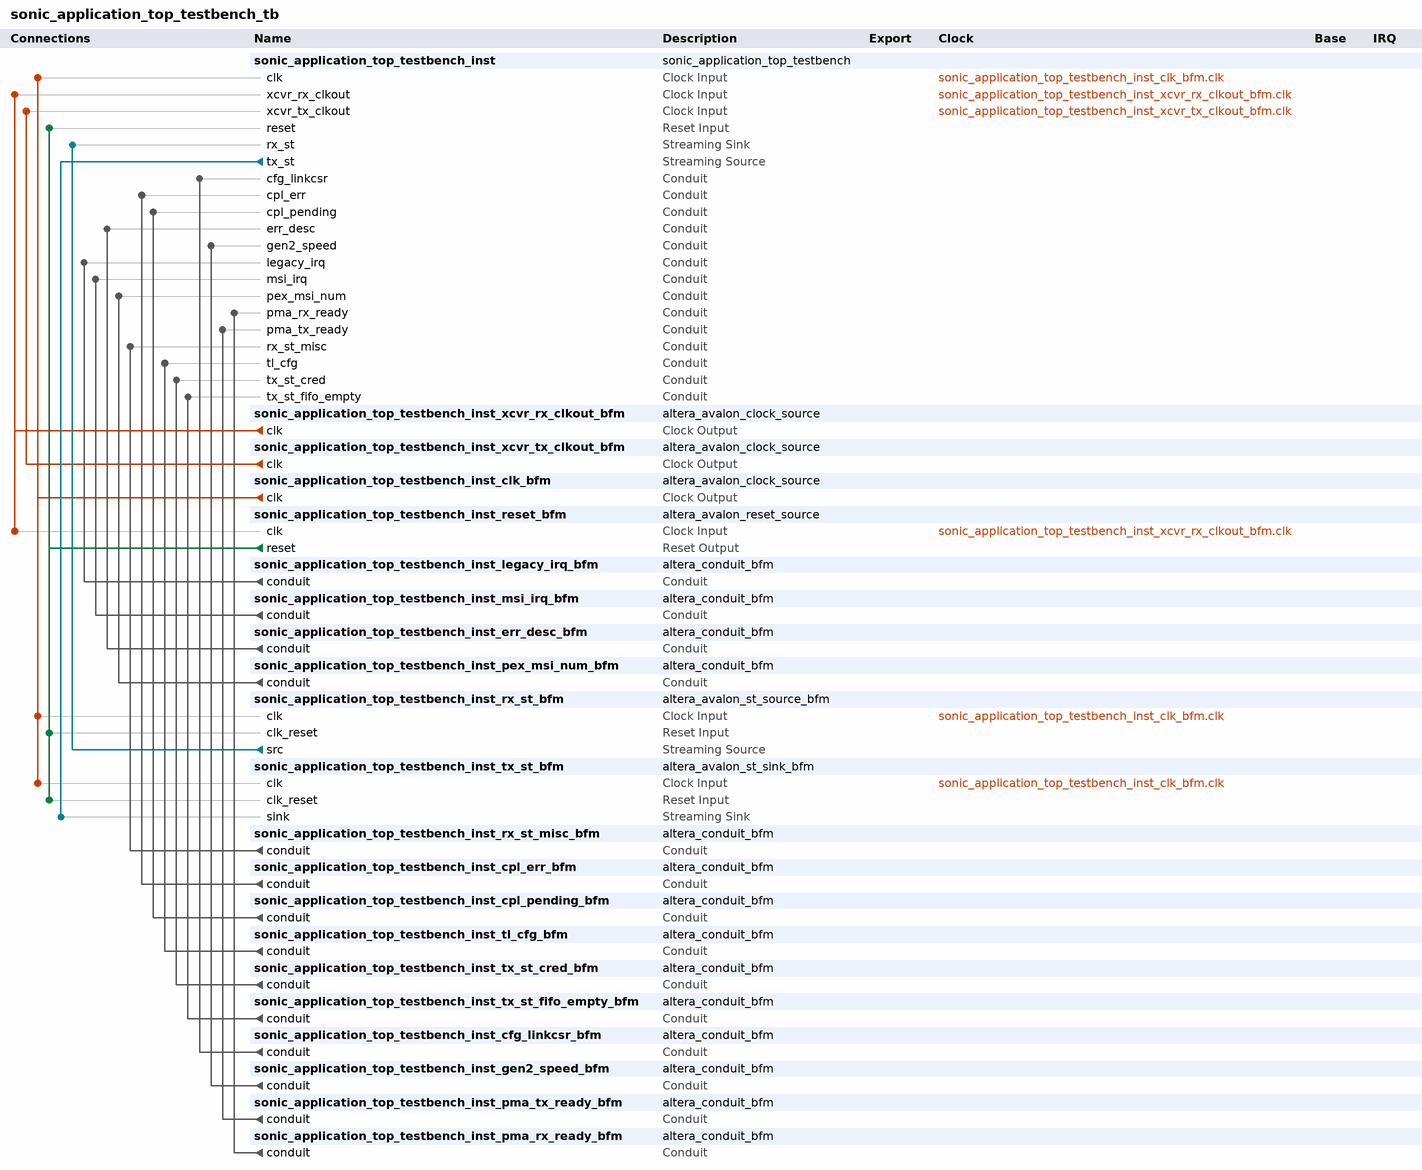
[diagram p0: system contents]
# Platform Designer (Qsys) system sonic_application_top_testbench_tb
# Parameters at their usual value, and those the tool derives, are not listed.
package require -exact qsys 11.0
create_system sonic_application_top_testbench_tb
set_project_property DEVICE_FAMILY STRATIXIV

add_instance sonic_application_top_testbench_inst sonic_application_top_testbench 1.0

add_instance sonic_application_top_testbench_inst_xcvr_rx_clkout_bfm altera_avalon_clock_source 11.0
set_instance_parameter_value sonic_application_top_testbench_inst_xcvr_rx_clkout_bfm CLOCK_RATE 257

add_instance sonic_application_top_testbench_inst_xcvr_tx_clkout_bfm altera_avalon_clock_source 11.0
set_instance_parameter_value sonic_application_top_testbench_inst_xcvr_tx_clkout_bfm CLOCK_RATE 257

add_instance sonic_application_top_testbench_inst_clk_bfm altera_avalon_clock_source 11.0
set_instance_parameter_value sonic_application_top_testbench_inst_clk_bfm CLOCK_RATE 250

add_instance sonic_application_top_testbench_inst_reset_bfm altera_avalon_reset_source 11.0
set_instance_parameter_value sonic_application_top_testbench_inst_reset_bfm ASSERT_HIGH_RESET 0
set_instance_parameter_value sonic_application_top_testbench_inst_reset_bfm INITIAL_RESET_CYCLES 50

add_instance sonic_application_top_testbench_inst_legacy_irq_bfm altera_conduit_bfm 11.0
set_instance_parameter_value sonic_application_top_testbench_inst_legacy_irq_bfm SIGNAL_ROLES sts,ack
set_instance_parameter_value sonic_application_top_testbench_inst_legacy_irq_bfm SIGNAL_WIDTHS 1,1
set_instance_parameter_value sonic_application_top_testbench_inst_legacy_irq_bfm SIGNAL_DIRECTIONS input,output

add_instance sonic_application_top_testbench_inst_msi_irq_bfm altera_conduit_bfm 11.0
set_instance_parameter_value sonic_application_top_testbench_inst_msi_irq_bfm SIGNAL_ROLES num,ack,req,tc
set_instance_parameter_value sonic_application_top_testbench_inst_msi_irq_bfm SIGNAL_WIDTHS 5,1,1,3
set_instance_parameter_value sonic_application_top_testbench_inst_msi_irq_bfm SIGNAL_DIRECTIONS input,output,input,input

add_instance sonic_application_top_testbench_inst_err_desc_bfm altera_conduit_bfm 11.0
set_instance_parameter_value sonic_application_top_testbench_inst_err_desc_bfm SIGNAL_WIDTHS 128
set_instance_parameter_value sonic_application_top_testbench_inst_err_desc_bfm SIGNAL_DIRECTIONS input

add_instance sonic_application_top_testbench_inst_pex_msi_num_bfm altera_conduit_bfm 11.0
set_instance_parameter_value sonic_application_top_testbench_inst_pex_msi_num_bfm SIGNAL_WIDTHS 5
set_instance_parameter_value sonic_application_top_testbench_inst_pex_msi_num_bfm SIGNAL_DIRECTIONS input

add_instance sonic_application_top_testbench_inst_rx_st_bfm altera_avalon_st_source_bfm 11.0
set_instance_parameter_value sonic_application_top_testbench_inst_rx_st_bfm USE_PACKET 1
set_instance_parameter_value sonic_application_top_testbench_inst_rx_st_bfm USE_CHANNEL 0
set_instance_parameter_value sonic_application_top_testbench_inst_rx_st_bfm USE_ERROR 1
set_instance_parameter_value sonic_application_top_testbench_inst_rx_st_bfm USE_READY 1
set_instance_parameter_value sonic_application_top_testbench_inst_rx_st_bfm USE_VALID 1
set_instance_parameter_value sonic_application_top_testbench_inst_rx_st_bfm USE_EMPTY 1
set_instance_parameter_value sonic_application_top_testbench_inst_rx_st_bfm ST_SYMBOL_W 128
set_instance_parameter_value sonic_application_top_testbench_inst_rx_st_bfm ST_NUMSYMBOLS 1
set_instance_parameter_value sonic_application_top_testbench_inst_rx_st_bfm ST_CHANNEL_W 1
set_instance_parameter_value sonic_application_top_testbench_inst_rx_st_bfm ST_ERROR_W 1
set_instance_parameter_value sonic_application_top_testbench_inst_rx_st_bfm ST_MAX_CHANNELS 0

add_instance sonic_application_top_testbench_inst_tx_st_bfm altera_avalon_st_sink_bfm 11.0
set_instance_parameter_value sonic_application_top_testbench_inst_tx_st_bfm USE_PACKET 1
set_instance_parameter_value sonic_application_top_testbench_inst_tx_st_bfm USE_CHANNEL 0
set_instance_parameter_value sonic_application_top_testbench_inst_tx_st_bfm USE_ERROR 1
set_instance_parameter_value sonic_application_top_testbench_inst_tx_st_bfm USE_READY 1
set_instance_parameter_value sonic_application_top_testbench_inst_tx_st_bfm USE_VALID 1
set_instance_parameter_value sonic_application_top_testbench_inst_tx_st_bfm USE_EMPTY 1
set_instance_parameter_value sonic_application_top_testbench_inst_tx_st_bfm ST_SYMBOL_W 128
set_instance_parameter_value sonic_application_top_testbench_inst_tx_st_bfm ST_NUMSYMBOLS 1
set_instance_parameter_value sonic_application_top_testbench_inst_tx_st_bfm ST_CHANNEL_W 1
set_instance_parameter_value sonic_application_top_testbench_inst_tx_st_bfm ST_ERROR_W 1
set_instance_parameter_value sonic_application_top_testbench_inst_tx_st_bfm ST_READY_LATENCY 0
set_instance_parameter_value sonic_application_top_testbench_inst_tx_st_bfm ST_MAX_CHANNELS 0

add_instance sonic_application_top_testbench_inst_rx_st_misc_bfm altera_conduit_bfm 11.0
set_instance_parameter_value sonic_application_top_testbench_inst_rx_st_misc_bfm SIGNAL_ROLES stream_mask0,st_be0,st_bardec0
set_instance_parameter_value sonic_application_top_testbench_inst_rx_st_misc_bfm SIGNAL_WIDTHS 1,16,8
set_instance_parameter_value sonic_application_top_testbench_inst_rx_st_misc_bfm SIGNAL_DIRECTIONS input,output,output

add_instance sonic_application_top_testbench_inst_cpl_err_bfm altera_conduit_bfm 11.0
set_instance_parameter_value sonic_application_top_testbench_inst_cpl_err_bfm SIGNAL_WIDTHS 7
set_instance_parameter_value sonic_application_top_testbench_inst_cpl_err_bfm SIGNAL_DIRECTIONS input

add_instance sonic_application_top_testbench_inst_cpl_pending_bfm altera_conduit_bfm 11.0
set_instance_parameter_value sonic_application_top_testbench_inst_cpl_pending_bfm SIGNAL_WIDTHS 1
set_instance_parameter_value sonic_application_top_testbench_inst_cpl_pending_bfm SIGNAL_DIRECTIONS input

add_instance sonic_application_top_testbench_inst_tl_cfg_bfm altera_conduit_bfm 11.0
set_instance_parameter_value sonic_application_top_testbench_inst_tl_cfg_bfm SIGNAL_ROLES msicsr,prmcsr,devcsr,busdev,tcvcmap
set_instance_parameter_value sonic_application_top_testbench_inst_tl_cfg_bfm SIGNAL_WIDTHS 16,32,32,13,24
set_instance_parameter_value sonic_application_top_testbench_inst_tl_cfg_bfm SIGNAL_DIRECTIONS output,output,output,output,output

add_instance sonic_application_top_testbench_inst_tx_st_cred_bfm altera_conduit_bfm 11.0
set_instance_parameter_value sonic_application_top_testbench_inst_tx_st_cred_bfm SIGNAL_WIDTHS 36
set_instance_parameter_value sonic_application_top_testbench_inst_tx_st_cred_bfm SIGNAL_DIRECTIONS output

add_instance sonic_application_top_testbench_inst_tx_st_fifo_empty_bfm altera_conduit_bfm 11.0
set_instance_parameter_value sonic_application_top_testbench_inst_tx_st_fifo_empty_bfm SIGNAL_WIDTHS 1
set_instance_parameter_value sonic_application_top_testbench_inst_tx_st_fifo_empty_bfm SIGNAL_DIRECTIONS output

add_instance sonic_application_top_testbench_inst_cfg_linkcsr_bfm altera_conduit_bfm 11.0
set_instance_parameter_value sonic_application_top_testbench_inst_cfg_linkcsr_bfm SIGNAL_WIDTHS 32
set_instance_parameter_value sonic_application_top_testbench_inst_cfg_linkcsr_bfm SIGNAL_DIRECTIONS output

add_instance sonic_application_top_testbench_inst_gen2_speed_bfm altera_conduit_bfm 11.0
set_instance_parameter_value sonic_application_top_testbench_inst_gen2_speed_bfm SIGNAL_WIDTHS 1
set_instance_parameter_value sonic_application_top_testbench_inst_gen2_speed_bfm SIGNAL_DIRECTIONS input

add_instance sonic_application_top_testbench_inst_pma_tx_ready_bfm altera_conduit_bfm 11.0
set_instance_parameter_value sonic_application_top_testbench_inst_pma_tx_ready_bfm SIGNAL_WIDTHS 1
set_instance_parameter_value sonic_application_top_testbench_inst_pma_tx_ready_bfm SIGNAL_DIRECTIONS output

add_instance sonic_application_top_testbench_inst_pma_rx_ready_bfm altera_conduit_bfm 11.0
set_instance_parameter_value sonic_application_top_testbench_inst_pma_rx_ready_bfm SIGNAL_WIDTHS 1
set_instance_parameter_value sonic_application_top_testbench_inst_pma_rx_ready_bfm SIGNAL_DIRECTIONS output

# connections
add_connection sonic_application_top_testbench_inst_clk_bfm.clk sonic_application_top_testbench_inst.clk clock
add_connection sonic_application_top_testbench_inst_clk_bfm.clk sonic_application_top_testbench_inst_rx_st_bfm.clk clock
add_connection sonic_application_top_testbench_inst_clk_bfm.clk sonic_application_top_testbench_inst_tx_st_bfm.clk clock
add_connection sonic_application_top_testbench_inst_xcvr_rx_clkout_bfm.clk sonic_application_top_testbench_inst.xcvr_rx_clkout clock
add_connection sonic_application_top_testbench_inst_xcvr_rx_clkout_bfm.clk sonic_application_top_testbench_inst_reset_bfm.clk clock
add_connection sonic_application_top_testbench_inst_xcvr_tx_clkout_bfm.clk sonic_application_top_testbench_inst.xcvr_tx_clkout clock
add_connection sonic_application_top_testbench_inst_reset_bfm.reset sonic_application_top_testbench_inst.reset reset
add_connection sonic_application_top_testbench_inst_reset_bfm.reset sonic_application_top_testbench_inst_rx_st_bfm.clk_reset reset
add_connection sonic_application_top_testbench_inst_reset_bfm.reset sonic_application_top_testbench_inst_tx_st_bfm.clk_reset reset
add_connection sonic_application_top_testbench_inst.tx_st sonic_application_top_testbench_inst_tx_st_bfm.sink avalon_streaming
add_connection sonic_application_top_testbench_inst_rx_st_bfm.src sonic_application_top_testbench_inst.rx_st avalon_streaming
add_connection sonic_application_top_testbench_inst_cfg_linkcsr_bfm.conduit sonic_application_top_testbench_inst.cfg_linkcsr conduit
add_connection sonic_application_top_testbench_inst_cpl_err_bfm.conduit sonic_application_top_testbench_inst.cpl_err conduit
add_connection sonic_application_top_testbench_inst_cpl_pending_bfm.conduit sonic_application_top_testbench_inst.cpl_pending conduit
add_connection sonic_application_top_testbench_inst_err_desc_bfm.conduit sonic_application_top_testbench_inst.err_desc conduit
add_connection sonic_application_top_testbench_inst_gen2_speed_bfm.conduit sonic_application_top_testbench_inst.gen2_speed conduit
add_connection sonic_application_top_testbench_inst_legacy_irq_bfm.conduit sonic_application_top_testbench_inst.legacy_irq conduit
add_connection sonic_application_top_testbench_inst_msi_irq_bfm.conduit sonic_application_top_testbench_inst.msi_irq conduit
add_connection sonic_application_top_testbench_inst_pex_msi_num_bfm.conduit sonic_application_top_testbench_inst.pex_msi_num conduit
add_connection sonic_application_top_testbench_inst_pma_rx_ready_bfm.conduit sonic_application_top_testbench_inst.pma_rx_ready conduit
add_connection sonic_application_top_testbench_inst_pma_tx_ready_bfm.conduit sonic_application_top_testbench_inst.pma_tx_ready conduit
add_connection sonic_application_top_testbench_inst_rx_st_misc_bfm.conduit sonic_application_top_testbench_inst.rx_st_misc conduit
add_connection sonic_application_top_testbench_inst_tl_cfg_bfm.conduit sonic_application_top_testbench_inst.tl_cfg conduit
add_connection sonic_application_top_testbench_inst_tx_st_cred_bfm.conduit sonic_application_top_testbench_inst.tx_st_cred conduit
add_connection sonic_application_top_testbench_inst_tx_st_fifo_empty_bfm.conduit sonic_application_top_testbench_inst.tx_st_fifo_empty conduit

save_system sonic_application_top_testbench_tb.qsys
